# EAGLE schematic faout (EAGLE 7.1.0)
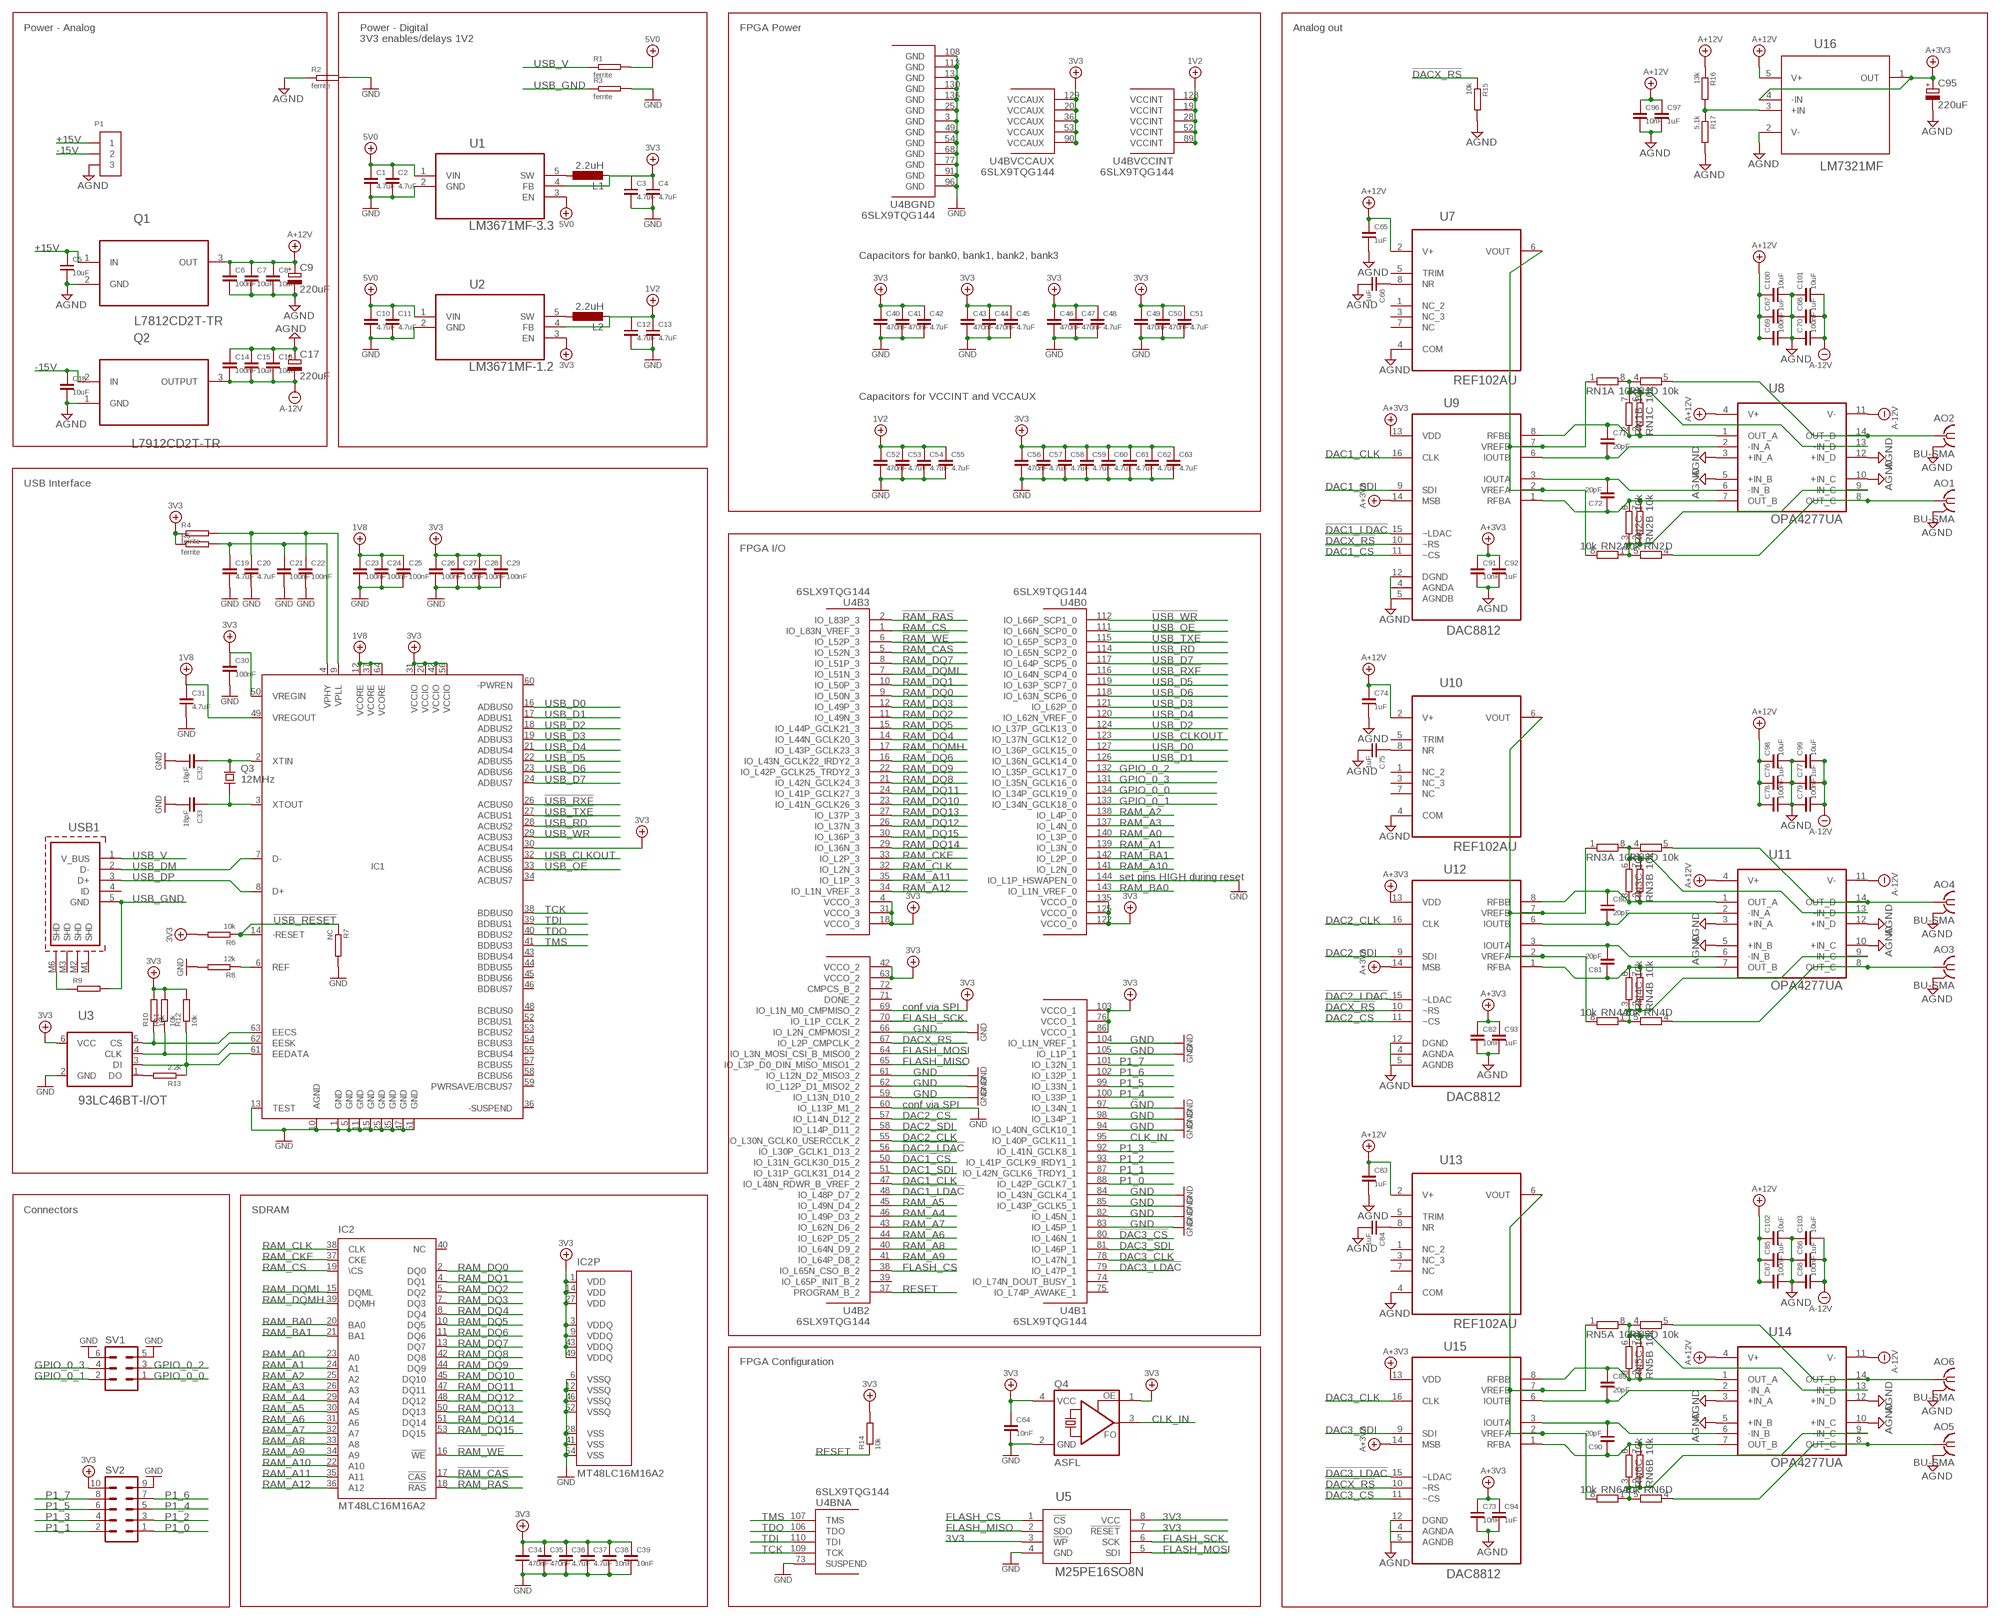
[diagram p0: schematic, sheet 1]

## Parts
AO1  BU-SMA  [BU-SMA-H]
AO2  BU-SMA  [BU-SMA-H]
AO3  BU-SMA  [BU-SMA-H]
AO4  BU-SMA  [BU-SMA-H]
AO5  BU-SMA  [BU-SMA-H]
AO6  BU-SMA  [BU-SMA-H]
C1  4.7uF  C_EU0603  [R0603]
C2  4.7uF  C_EU0603  [R0603]
C3  4.7uF  C_EU0603  [R0603]
C4  4.7uF  C_EU0603  [R0603]
C5  10uF  C_EU0805  [R0805]
C6  100nF  C_EU0603  [R0603]
C7  10uF  C_EU0805  [R0805]
C8  10uF  C_EU0805  [R0805]
C9  220uF  CPOL-EUE  [PANASONIC_E]
C10  4.7uF  C_EU0603  [R0603]
C11  4.7uF  C_EU0603  [R0603]
C12  4.7uF  C_EU0603  [R0603]
C13  4.7uF  C_EU0603  [R0603]
C14  100nF  C_EU0603  [R0603]
C15  10uF  C_EU0805  [R0805]
C16  10uF  C_EU0805  [R0805]
C17  220uF  CPOL-EUE  [PANASONIC_E]
C18  10uF  C_EU0805  [R0805]
C19  4.7uF  C_EU0603  [R0603]
C20  4.7uF  C_EU0603  [R0603]
C21  100nF  C_EU0603  [R0603]
C22  100nF  C_EU0603  [R0603]
C23  100nF  C_EU0603  [R0603]
C24  100nF  C_EU0603  [R0603]
C25  100nF  C_EU0603  [R0603]
C26  100nF  C_EU0603  [R0603]
C27  100nF  C_EU0603  [R0603]
C28  100nF  C_EU0603  [R0603]
C29  100nF  C_EU0603  [R0603]
C30  100nF  C_EU0603  [R0603]
C31  4.7uF  C_EU0603  [R0603]
C32  18pF  C_EU0603  [R0603]
C33  18pF  C_EU0603  [R0603]
C34  470nF  C_EU0603  [R0603]
C35  470nF  C_EU0603  [R0603]
C36  4.7uF  C_EU0603  [R0603]
C37  4.7uF  C_EU0603  [R0603]
C38  10nF  C_EU0603  [R0603]
C39  10nF  C_EU0603  [R0603]
C40  470nF  C_EU0603  [R0603]
C41  470nF  C_EU0603  [R0603]
C42  4.7uF  C_EU0603  [R0603]
C43  470nF  C_EU0603  [R0603]
C44  470nF  C_EU0603  [R0603]
C45  4.7uF  C_EU0603  [R0603]
C46  470nF  C_EU0603  [R0603]
C47  470nF  C_EU0603  [R0603]
C48  4.7uF  C_EU0603  [R0603]
C49  470nF  C_EU0603  [R0603]
C50  470nF  C_EU0603  [R0603]
C51  4.7uF  C_EU0603  [R0603]
C52  470nF  C_EU0603  [R0603]
C53  4.7uF  C_EU0603  [R0603]
C54  4.7uF  C_EU0603  [R0603]
C55  4.7uF  C_EU0603  [R0603]
C56  470nF  C_EU0603  [R0603]
C57  4.7uF  C_EU0603  [R0603]
C58  4.7uF  C_EU0603  [R0603]
C59  4.7uF  C_EU0603  [R0603]
C60  4.7uF  C_EU0603  [R0603]
C61  4.7uF  C_EU0603  [R0603]
C62  4.7uF  C_EU0603  [R0603]
C63  4.7uF  C_EU0603  [R0603]
C64  10nF  C_EU0603  [R0603]
C65  1uF  C_EU0603  [R0603]
C66  1uF  C_EU0603  [R0603]
C67  1uF  C_EU0603  [R0603]
C68  1uF  C_EU0603  [R0603]
C69  100nF  C_EU0603  [R0603]
C70  100nF  C_EU0603  [R0603]
C71  20pF  C_EU0603  [R0603]
C72  20pF  C_EU0603  [R0603]
C73  10nF  C_EU0603  [R0603]
C74  1uF  C_EU0603  [R0603]
C75  1uF  C_EU0603  [R0603]
C76  1uF  C_EU0603  [R0603]
C77  1uF  C_EU0603  [R0603]
C78  100nF  C_EU0603  [R0603]
C79  100nF  C_EU0603  [R0603]
C80  20pF  C_EU0603  [R0603]
C81  20pF  C_EU0603  [R0603]
C82  10nF  C_EU0603  [R0603]
C83  1uF  C_EU0603  [R0603]
C84  1uF  C_EU0603  [R0603]
C85  1uF  C_EU0603  [R0603]
C86  1uF  C_EU0603  [R0603]
C87  100nF  C_EU0603  [R0603]
C88  100nF  C_EU0603  [R0603]
C89  20pF  C_EU0603  [R0603]
C90  20pF  C_EU0603  [R0603]
C91  10nF  C_EU0603  [R0603]
C92  1uF  C_EU0603  [R0603]
C93  1uF  C_EU0603  [R0603]
C94  1uF  C_EU0603  [R0603]
C95  220uF  CPOL-EUE  [PANASONIC_E]
C96  10nF  C_EU0603  [R0603]
C97  1uF  C_EU0603  [R0603]
C98  10uF  C_EU0805  [R0805]
C99  10uF  C_EU0805  [R0805]
C100  10uF  C_EU0805  [R0805]
C101  10uF  C_EU0805  [R0805]
C102  10uF  C_EU0805  [R0805]
C103  10uF  C_EU0805  [R0805]
IC1  FT2232HL  [TQFP64-12X12]
IC2  MT48LC16M16A2  [TSOP54-400]
L1  2.2uH  L-EUL5038P  [L5038P]
L2  2.2uH  L-EUL5038P  [L5038P]
P1  TE_CONN_MTE_HEADER3R  [TE_CONN_MTE_HEADER3_R]
Q1  L7812CD2T-TR  [TO254P1524X460-3N]
Q2  L7912CD2T-TR  [TO254P1524X460-3N]
Q3  12MHz  TXC_QUARTZ_7A  [TXC_QUARTZ_7A]
Q4  ASFL  [ASF]
R1  ferrite  R_EU1206  [R1206]
R2  ferrite  R_EU1206  [R1206]
R3  ferrite  R_EU1206  [R1206]
R4  ferrite  R_EU0603  [R0603]
R5  ferrite  R_EU0603  [R0603]
R6  10k  R_EU0603  [R0603]
R7  NC  R_EU0603  [R0603]
R8  12k  R_EU0603  [R0603]
R9  R_EU0603  [R0603]
R10  10k  R_EU0603  [R0603]
R11  10k  R_EU0603  [R0603]
R12  10k  R_EU0603  [R0603]
R13  2.2k  R_EU0603  [R0603]
R14  10k  R_EU0603  [R0603]
R15  10k  R_EU0603  [R0603]
R16  13k  R_EU0603  [R0603]
R17  5.1k  R_EU0603  [R0603]
RN1  10k  4R-NEXBV8V  [EXBV8V]
RN2  10k  4R-NEXBV8V  [EXBV8V]
RN3  10k  4R-NEXBV8V  [EXBV8V]
RN4  10k  4R-NEXBV8V  [EXBV8V]
RN5  10k  4R-NEXBV8V  [EXBV8V]
RN6  10k  4R-NEXBV8V  [EXBV8V]
SV1  ML6L  [ML6L]
SV2  ML10  [ML10]
U1  LM3671MF-3.3  [SOT95P284X122-5N]
U2  LM3671MF-1.2  [SOT95P284X122-5N]
U3  93LC46BT-I/OT  [SOT95P280X145-6N]
U4  6SLX9TQG144  [TQ144]
U5  M25PE16SO8N  [SOIC127P600X175-8N]
U7  REF102AU  [SOIC127P600X175-8N]
U8  OPA4277UA  [SOIC127P600X175-14N]
U9  DAC8812  [SOP65P640X120-16N]
U10  REF102AU  [SOIC127P600X175-8N]
U11  OPA4277UA  [SOIC127P600X175-14N]
U12  DAC8812  [SOP65P640X120-16N]
U13  REF102AU  [SOIC127P600X175-8N]
U14  OPA4277UA  [SOIC127P600X175-14N]
U15  DAC8812  [SOP65P640X120-16N]
U16  LM7321MF  [SOT95P300X120-5N]
USB1  MOLEX_USB_105017-0001  [MOLEX_105017-0001]

## Nets
1V2: C12.1 C13.1 C52.1 C53.1 C54.1 C55.1 L2.2 U2.4(FB) U4.19(BVCCINT:VCCINT) U4.28(BVCCINT:VCCINT) U4.52(BVCCINT:VCCINT) U4.89(BVCCINT:VCCINT) U4.128(BVCCINT:VCCINT)
1V8: C23.1 C24.1 C25.1 C31.1 IC1.12(VCORE) IC1.37(VCORE) IC1.49(VREGOUT) IC1.64(VCORE)
3V3: C3.1 C4.1 C26.1 C27.1 C28.1 C29.1 C30.1 C34.1 C35.1 C36.1 C37.1 C38.1 C39.1 C40.1 C41.1 C42.1 C43.1 C44.1 C45.1 C46.1 C47.1 C48.1 C49.1 C50.1 C51.1 C56.1 C57.1 C58.1 C59.1 C60.1 C61.1 C62.1 C63.1 C64.1 IC1.20(VCCIO) IC1.30(ACBUS4) IC1.31(VCCIO) IC1.42(VCCIO) IC1.50(VREGIN) IC1.56(VCCIO) IC2.1(VDD) IC2.3(VDDQ) IC2.9(VDDQ) IC2.14(VDD) IC2.27(VDD) IC2.43(VDDQ) IC2.49(VDDQ) L1.2 Q4.1(OE) Q4.4(VCC) R4.1 R5.1 R6.2 R10.2 R11.2 R12.2 R14.2 SV2.10 U1.4(FB) U2.3(EN) U3.6(VCC) U4.4(B3:VCCO_3) U4.18(B3:VCCO_3) U4.20(BVCCAUX:VCCAUX) U4.31(B3:VCCO_3) U4.36(BVCCAUX:VCCAUX) U4.42(B2:VCCO_2) U4.53(BVCCAUX:VCCAUX) U4.63(B2:VCCO_2) U4.69(B2:IO_L1N_M0_CMPMISO_2) U4.76(B1:VCCO_1) U4.86(B1:VCCO_1) U4.90(BVCCAUX:VCCAUX) U4.103(B1:VCCO_1) U4.122(B0:VCCO_0) U4.125(B0:VCCO_0) U4.129(BVCCAUX:VCCAUX) U4.135(B0:VCCO_0) U5.3(!WP) U5.7(!RESET) U5.8(VCC)
5V0: C1.1 C2.1 C10.1 C11.1 R1.2 U1.1(VIN) U1.3(EN) U2.1(VIN)
!DAC1_CS: U4.50(B2:IO_L31N_GCLK30_D15_2) U9.11(~CS)
!DAC1_LDAC: U4.48(B2:IO_L48P_D7_2) U9.15(~LDAC)
!DAC2_CS: U4.57(B2:IO_L14N_D12_2) U12.11(~CS)
!DAC2_LDAC: U4.56(B2:IO_L30P_GCLK1_D13_2) U12.15(~LDAC)
!DAC3_CS: U4.80(B1:IO_L46N_1) U15.11(~CS)
!DAC3_LDAC: U4.79(B1:IO_L47P_1) U15.15(~LDAC)
!DACX_RS: R15.1 U4.67(B2:IO_L2P_CMPCLK_2) U9.10(~RS) U12.10(~RS) U15.10(~RS)
!RAM_CAS: IC2.17(!CAS) U4.5(B3:IO_L52N_3)
!RAM_RAS: IC2.18(!RAS) U4.2(B3:IO_L83P_3)
!RAM_WE: IC2.16(!WE) U4.6(B3:IO_L52P_3)
!USB_OE: IC1.33(ACBUS6) U4.111(B0:IO_L66N_SCP0_0)
!USB_RD: IC1.28(ACBUS2) U4.114(B0:IO_L65N_SCP2_0)
!USB_RESET: IC1.14(-RESET) R6.1 R7.1
!USB_RXF: IC1.26(ACBUS0) U4.116(B0:IO_L64N_SCP4_0)
!USB_TXE: IC1.27(ACBUS1) U4.115(B0:IO_L65P_SCP3_0)
!USB_WR: IC1.29(ACBUS3) U4.112(B0:IO_L66P_SCP1_0)
+15V: C5.1 P1.P$1 Q1.1(IN)
-15V: C18.1 P1.P$2 Q2.2(IN)
A+3V3: C73.1 C82.1 C91.1 C92.1 C93.1 C94.1 C95.+ U9.13(VDD) U9.14(MSB) U12.13(VDD) U12.14(MSB) U15.13(VDD) U15.14(MSB) U16.1(OUT) U16.4(-IN)
A+12V: C6.1 C7.1 C8.1 C9.+ C65.1 C67.1 C69.1 C74.1 C76.1 C78.1 C83.1 C85.1 C87.1 C96.1 C97.1 C98.1 C100.1 C102.1 Q1.3(OUT) R16.1 U7.2(V+) U8.4(V+) U10.2(V+) U11.4(V+) U13.2(V+) U14.4(V+) U16.5(V+)
A-12V: C14.2 C15.2 C16.2 C17.- C68.2 C70.2 C77.2 C79.2 C86.2 C88.2 C99.2 C101.2 C103.2 Q2.3(OUTPUT) U8.11(V-) U11.11(V-) U14.11(V-)
AGND: AO1.2 AO1.3 AO1.4 AO1.5 AO2.2 AO2.3 AO2.4 AO2.5 AO3.2 AO3.3 AO3.4 AO3.5 AO4.2 AO4.3 AO4.4 AO4.5 AO5.2 AO5.3 AO5.4 AO5.5 AO6.2 AO6.3 AO6.4 AO6.5 C5.2 C6.2 C7.2 C8.2 C9.- C14.1 C15.1 C16.1 C17.+ C18.2 C65.2 C66.2 C67.2 C68.1 C69.2 C70.1 C73.2 C74.2 C75.2 C76.2 C77.1 C78.2 C79.1 C82.2 C83.2 C84.2 C85.2 C86.1 C87.2 C88.1 C91.2 C92.2 C93.2 C94.2 C95.- C96.2 C97.2 C98.2 C99.1 C100.2 C101.1 C102.2 C103.1 P1.P$3 Q1.2(GND) Q2.1(GND) R2.1 R15.2 R17.2 U7.4(COM) U8.3(+IN_A) U8.5(+IN_B) U8.10(+IN_C) U8.12(+IN_D) U9.4(AGNDA) U9.5(AGNDB) U9.12(DGND) U10.4(COM) U11.3(+IN_A) U11.5(+IN_B) U11.10(+IN_C) U11.12(+IN_D) U12.4(AGNDA) U12.5(AGNDB) U12.12(DGND) U13.4(COM) U14.3(+IN_A) U14.5(+IN_B) U14.10(+IN_C) U14.12(+IN_D) U15.4(AGNDA) U15.5(AGNDB) U15.12(DGND) U16.2(V-)
CLK_IN: Q4.3(FO) U4.95(B1:IO_L40P_GCLK11_1)
DAC1_CLK: U4.47(B2:IO_L48N_RDWR_B_VREF_2) U9.16(CLK)
DAC1_IOUTA: C72.2 U8.6(-IN_B) U9.3(IOUTA)
DAC1_IOUTB: C71.2 U8.2(-IN_A) U9.6(IOUTB)
DAC1_RFBA: C72.1 RN2.6 RN2.7 U8.7(OUT_B) U9.1(RFBA)
DAC1_RFBB: C71.1 RN1.2 RN1.3 U8.1(OUT_A) U9.8(RFBB)
DAC1_SDI: U4.51(B2:IO_L31P_GCLK31_D14_2) U9.9(SDI)
DAC1_VOUTA: AO1.1 RN2.4 U8.8(OUT_C)
DAC1_VOUTB: AO2.1 RN1.5 U8.14(OUT_D)
DAC1_VREF: RN1.1 RN2.8 U7.6(VOUT) U9.2(VREFA) U9.7(VREFB)
DAC2_CLK: U4.55(B2:IO_L30N_GCLK0_USERCCLK_2) U12.16(CLK)
DAC2_IOUTA: C81.2 U11.6(-IN_B) U12.3(IOUTA)
DAC2_IOUTB: C80.2 U11.2(-IN_A) U12.6(IOUTB)
DAC2_RFBA: C81.1 RN4.6 RN4.7 U11.7(OUT_B) U12.1(RFBA)
DAC2_RFBB: C80.1 RN3.2 RN3.3 U11.1(OUT_A) U12.8(RFBB)
DAC2_SDI: U4.58(B2:IO_L14P_D11_2) U12.9(SDI)
DAC2_VOUTA: AO3.1 RN4.4 U11.8(OUT_C)
DAC2_VOUTB: AO4.1 RN3.5 U11.14(OUT_D)
DAC2_VREF: RN3.1 RN4.8 U10.6(VOUT) U12.2(VREFA) U12.7(VREFB)
DAC3_CLK: U4.78(B1:IO_L47N_1) U15.16(CLK)
DAC3_IOUTA: C90.2 U14.6(-IN_B) U15.3(IOUTA)
DAC3_IOUTB: C89.2 U14.2(-IN_A) U15.6(IOUTB)
DAC3_RFBA: C90.1 RN6.6 RN6.7 U14.7(OUT_B) U15.1(RFBA)
DAC3_RFBB: C89.1 RN5.2 RN5.3 U14.1(OUT_A) U15.8(RFBB)
DAC3_SDI: U4.81(B1:IO_L46P_1) U15.9(SDI)
DAC3_VOUTA: AO5.1 RN6.4 U14.8(OUT_C)
DAC3_VOUTB: AO6.1 RN5.5 U14.14(OUT_D)
DAC3_VREF: RN5.1 RN6.8 U13.6(VOUT) U15.2(VREFA) U15.7(VREFB)
EECS: IC1.63(EECS) R10.1 U3.5(CS)
EEDATA: IC1.61(EEDATA) R12.1 R13.1 U3.3(DI)
EESK: IC1.62(EESK) R11.1 U3.4(CLK)
FLASH_CS: U4.38(B2:IO_L65N_CSO_B_2) U5.1(!CS)
FLASH_MISO: U4.65(B2:IO_L3P_D0_DIN_MISO_MISO1_2) U5.2(SDO)
FLASH_MOSI: U4.64(B2:IO_L3N_MOSI_CSI_B_MISO0_2) U5.5(SDI)
FLASH_SCK: U4.70(B2:IO_L1P_CCLK_2) U5.6(SCK)
GND: C1.2 C2.2 C3.2 C4.2 C10.2 C11.2 C12.2 C13.2 C19.2 C20.2 C21.2 C22.2 C23.2 C24.2 C25.2 C26.2 C27.2 C28.2 C29.2 C30.2 C31.2 C32.2 C33.2 C34.2 C35.2 C36.2 C37.2 C38.2 C39.2 C40.2 C41.2 C42.2 C43.2 C44.2 C45.2 C46.2 C47.2 C48.2 C49.2 C50.2 C51.2 C52.2 C53.2 C54.2 C55.2 C56.2 C57.2 C58.2 C59.2 C60.2 C61.2 C62.2 C63.2 C64.2 IC1.1(GND) IC1.5(GND) IC1.10(AGND) IC1.11(GND) IC1.13(TEST) IC1.15(GND) IC1.25(GND) IC1.35(GND) IC1.47(GND) IC1.51(GND) IC2.6(VSSQ) IC2.12(VSSQ) IC2.28(VSS) IC2.41(VSS) IC2.46(VSSQ) IC2.52(VSSQ) IC2.54(VSS) Q4.2(GND) R2.2 R3.2 R7.2 R8.2 SV1.5 SV1.6 SV2.9 U1.2(GND) U2.2(GND) U3.2(GND) U4.3(BGND:GND) U4.13(BGND:GND) U4.25(BGND:GND) U4.49(BGND:GND) U4.54(BGND:GND) U4.59(B2:IO_L13N_D10_2) U4.60(B2:IO_L13P_M1_2) U4.61(B2:IO_L12N_D2_MISO3_2) U4.62(B2:IO_L12P_D1_MISO2_2) U4.66(B2:IO_L2N_CMPMOSI_2) U4.68(BGND:GND) U4.73(BNA:SUSPEND) U4.77(BGND:GND) U4.82(B1:IO_L45N_1) U4.83(B1:IO_L45P_1) U4.84(B1:IO_L43N_GCLK4_1) U4.85(B1:IO_L43P_GCLK5_1) U4.91(BGND:GND) U4.94(B1:IO_L40N_GCLK10_1) U4.96(BGND:GND) U4.97(B1:IO_L34N_1) U4.98(B1:IO_L34P_1) U4.104(B1:IO_L1N_VREF_1) U4.105(B1:IO_L1P_1) U4.108(BGND:GND) U4.113(BGND:GND) U4.130(BGND:GND) U4.136(BGND:GND) U4.144(B0:IO_L1P_HSWAPEN_0) U5.4(GND)
GPIO_0_0: SV1.1 U4.134(B0:IO_L34P_GCLK19_0)
GPIO_0_1: SV1.2 U4.133(B0:IO_L34N_GCLK18_0)
GPIO_0_2: SV1.3 U4.132(B0:IO_L35P_GCLK17_0)
GPIO_0_3: SV1.4 U4.131(B0:IO_L35N_GCLK16_0)
N$1: C32.1 IC1.2(XTIN) Q3.1
N$2: C33.1 IC1.3(XTOUT) Q3.2
N$4: C66.1 U7.8(NR)
N$5: C19.1 C21.1 IC1.4(VPHY) R5.2
N$6: R13.2 U3.1(DO)
N$7: C20.1 C22.1 IC1.9(VPLL) R4.2
N$8: RN2.1 RN2.2 RN2.3 RN2.5 U8.9(-IN_C)
N$9: RN4.1 RN4.2 RN4.3 RN4.5 U11.9(-IN_C)
N$10: RN5.4 RN5.6 RN5.7 RN5.8 U14.13(-IN_D)
N$11: C75.1 U10.8(NR)
N$12: C84.1 U13.8(NR)
N$13: R16.2 R17.1 U16.3(+IN)
N$14: RN6.1 RN6.2 RN6.3 RN6.5 U14.9(-IN_C)
N$15: R9.1 USB1.M6(SHD)
N$16: RN1.4 RN1.6 RN1.7 RN1.8 U8.13(-IN_D)
N$17: RN3.4 RN3.6 RN3.7 RN3.8 U11.13(-IN_D)
N$24: L1.1 U1.5(SW)
N$25: L2.1 U2.5(SW)
P1_0: SV2.1 U4.88(B1:IO_L42P_GCLK7_1)
P1_1: SV2.2 U4.87(B1:IO_L42N_GCLK6_TRDY1_1)
P1_2: SV2.3 U4.93(B1:IO_L41P_GCLK9_IRDY1_1)
P1_3: SV2.4 U4.92(B1:IO_L41N_GCLK8_1)
P1_4: SV2.5 U4.100(B1:IO_L33P_1)
P1_5: SV2.6 U4.99(B1:IO_L33N_1)
P1_6: SV2.7 U4.102(B1:IO_L32P_1)
P1_7: SV2.8 U4.101(B1:IO_L32N_1)
RAM_A0: IC2.23(A0) U4.140(B0:IO_L3P_0)
RAM_A1: IC2.24(A1) U4.139(B0:IO_L3N_0)
RAM_A2: IC2.25(A2) U4.138(B0:IO_L4P_0)
RAM_A3: IC2.26(A3) U4.137(B0:IO_L4N_0)
RAM_A4: IC2.29(A4) U4.46(B2:IO_L49P_D3_2)
RAM_A5: IC2.30(A5) U4.45(B2:IO_L49N_D4_2)
RAM_A6: IC2.31(A6) U4.44(B2:IO_L62P_D5_2)
RAM_A7: IC2.32(A7) U4.43(B2:IO_L62N_D6_2)
RAM_A8: IC2.33(A8) U4.40(B2:IO_L64N_D9_2)
RAM_A9: IC2.34(A9) U4.41(B2:IO_L64P_D8_2)
RAM_A10: IC2.22(A10) U4.141(B0:IO_L2N_0)
RAM_A11: IC2.35(A11) U4.35(B3:IO_L1P_3)
RAM_A12: IC2.36(A12) U4.34(B3:IO_L1N_VREF_3)
RAM_BA0: IC2.20(BA0) U4.143(B0:IO_L1N_VREF_0)
RAM_BA1: IC2.21(BA1) U4.142(B0:IO_L2P_0)
RAM_CKE: IC2.37(CKE) U4.33(B3:IO_L2P_3)
RAM_CLK: IC2.38(CLK) U4.32(B3:IO_L2N_3)
RAM_CS: IC2.19(\CS) U4.1(B3:IO_L83N_VREF_3)
RAM_DQ0: IC2.2(DQ0) U4.9(B3:IO_L50N_3)
RAM_DQ1: IC2.4(DQ1) U4.10(B3:IO_L50P_3)
RAM_DQ2: IC2.5(DQ2) U4.11(B3:IO_L49N_3)
RAM_DQ3: IC2.7(DQ3) U4.12(B3:IO_L49P_3)
RAM_DQ4: IC2.8(DQ4) U4.14(B3:IO_L44N_GCLK20_3)
RAM_DQ5: IC2.10(DQ5) U4.15(B3:IO_L44P_GCLK21_3)
RAM_DQ6: IC2.11(DQ6) U4.16(B3:IO_L43N_GCLK22_IRDY2_3)
RAM_DQ7: IC2.13(DQ7) U4.8(B3:IO_L51P_3)
RAM_DQ8: IC2.42(DQ8) U4.21(B3:IO_L42N_GCLK24_3)
RAM_DQ9: IC2.44(DQ9) U4.22(B3:IO_L42P_GCLK25_TRDY2_3)
RAM_DQ10: IC2.45(DQ10) U4.23(B3:IO_L41N_GCLK26_3)
RAM_DQ11: IC2.47(DQ11) U4.24(B3:IO_L41P_GCLK27_3)
RAM_DQ12: IC2.48(DQ12) U4.26(B3:IO_L37N_3)
RAM_DQ13: IC2.50(DQ13) U4.27(B3:IO_L37P_3)
RAM_DQ14: IC2.51(DQ14) U4.29(B3:IO_L36N_3)
RAM_DQ15: IC2.53(DQ15) U4.30(B3:IO_L36P_3)
RAM_DQMH: IC2.39(DQMH) U4.17(B3:IO_L43P_GCLK23_3)
RAM_DQML: IC2.15(DQML) U4.7(B3:IO_L51N_3)
RESET: R14.1 U4.37(B2:PROGRAM_B_2)
TCK: IC1.38(BDBUS0) U4.109(BNA:TCK)
TDI: IC1.39(BDBUS1) U4.110(BNA:TDI)
TDO: IC1.40(BDBUS2) U4.106(BNA:TDO)
TMS: IC1.41(BDBUS3) U4.107(BNA:TMS)
USB_CLKOUT: IC1.32(ACBUS5) U4.123(B0:IO_L37N_GCLK12_0)
USB_D0: IC1.16(ADBUS0) U4.127(B0:IO_L36P_GCLK15_0)
USB_D1: IC1.17(ADBUS1) U4.126(B0:IO_L36N_GCLK14_0)
USB_D2: IC1.18(ADBUS2) U4.124(B0:IO_L37P_GCLK13_0)
USB_D3: IC1.19(ADBUS3) U4.121(B0:IO_L62P_0)
USB_D4: IC1.21(ADBUS4) U4.120(B0:IO_L62N_VREF_0)
USB_D5: IC1.22(ADBUS5) U4.119(B0:IO_L63P_SCP7_0)
USB_D6: IC1.23(ADBUS6) U4.118(B0:IO_L63N_SCP6_0)
USB_D7: IC1.24(ADBUS7) U4.117(B0:IO_L64P_SCP5_0)
USB_DM: IC1.7(D-) USB1.2(D-)
USB_DP: IC1.8(D+) USB1.3(D+)
USB_GND: R3.1 R9.2 USB1.5(GND)
USB_REF: IC1.6(REF) R8.1
USB_V: R1.1 USB1.1(V_BUS)
Unconnected: IC1.34(ACBUS7) IC1.36(-SUSPEND) IC1.43(BDBUS4) IC1.44(BDBUS5) IC1.45(BDBUS6) IC1.46(BDBUS7) IC1.48(BCBUS0) IC1.52(BCBUS1) IC1.53(BCBUS2) IC1.54(BCBUS3) IC1.55(BCBUS4) IC1.57(BCBUS5) IC1.58(BCBUS6) IC1.59(PWRSAVE/BCBUS7) IC1.60(-PWREN) IC2.40(NC) U4.39(B2:IO_L65P_INIT_B_2) U4.71(B2:DONE_2) U4.72(B2:CMPCS_B_2) U4.74(B1:IO_L74N_DOUT_BUSY_1) U4.75(B1:IO_L74P_AWAKE_1) U7.1(NC_2) U7.3(NC_3) U7.5(TRIM) U7.7(NC) U10.1(NC_2) U10.3(NC_3) U10.5(TRIM) U10.7(NC) U13.1(NC_2) U13.3(NC_3) U13.5(TRIM) U13.7(NC) USB1.4(ID) USB1.M1(SHD) USB1.M2(SHD) USB1.M3(SHD)

## Notes on the sheet
- Power - Analog | Power - Digital | FPGA Power | Analog out
- 3V3 enables/delays 1V2
- Capacitors for bank0, bank1, bank2, bank3
- Capacitors for VCCINT and VCCAUX
- USB Interface
- FPGA I/O
- set pins HIGH during reset
- conf via SPI
- conf via SPI
- Connectors | SDRAM
- FPGA Configuration

## Library data of the parts
AO1-AO6 = analog_out_lib:BU-SMA: FEMALE SMA CONNECTOR Radiall; OC_FARNELL: 1248989
C1-C4 C10-C13 C19 C20 C31 C36 C37 C42 C45 C48 C51 C53-C55 C57-C63 = faout:C_EU: Capacitor, EU Symbol; OC_FARNELL: 1833803
C5 C7 C8 C15 C16 C18 = faout:C_EU: Capacitor, EU Symbol; OC_FARNELL: 1867958
C6 C14 C21-C30 C69 C70 C78 C79 C87 C88 = faout:C_EU: Capacitor, EU Symbol; OC_FARNELL: 1740621
C9 C17 C95 = rcl:CPOL-EU: POLARIZED CAPACITOR, European symbol; OC_FARNELL: 9695680
C32 C33 C71 C72 C80 C81 C89 C90 = faout:C_EU: Capacitor, EU Symbol
C34 C35 C40 C41 C43 C44 C46 C47 C49 C50 C52 C56 = faout:C_EU: Capacitor, EU Symbol; OC_FARNELL: 1867949
C38 C39 C64 C73 C82 C91 C96 = faout:C_EU: Capacitor, EU Symbol; OC_FARNELL: 1759102
C65-C68 C74-C77 C83-C86 C92-C94 C97 = faout:C_EU: Capacitor, EU Symbol; OC_FARNELL: 1759409
C98-C103 = faout:C_EU: Capacitor, EU Symbol; OC_FARNELL: 1735530
IC1 = ftdichip-3:FT2232H: FT2232H USB2.0 High speed dual Serial/FIFO controller 64 pin device; OC_FARNELL: 1697461
IC2 = faout:MT48LC: Micron SDR SDRAM; OC_FARNELL: 2253738
L1 L2 = rcl:L-EU: INDUCTOR, European symbol; OC_FARNELL: 2145272
P1 = faout:TE_CONN_MTE_HEADER3; OC_FARNELL: 2429542
Q1 = faout:L7812CD2T-TR: V REG, 2VDO, 1.5A, 12V, 5%, 3D2PAK; MPN: L7812CD2T-TR; OC_FARNELL: 2296017; OC_NEWARK: 89K1392; PACKAGE: D2PAK; SUPPLIER: STMicroelectronics
Q2 = faout:L7912CD2T-TR; OC_FARNELL: 1564324
Q3 = faout:TXC_QUARTZ_7A; OC_FARNELL: 1841940
Q4 = crystal:ASF*: CRYSTAL CLOCK OSCILLATORS 5.0 Vdc or 3.3 Vdc - LOW PROFILE ULTRA MINIATURE CERAMIC SURFACE MOUNT Source: http://www.abracon.com/Oscillators/asf1-L-L1.pdf; MPN: ASFLM1-50.000MHZ-C-T; OC_FARNELL: 1838931; OC_NEWARK: 99M0411
R1-R3 = faout:R_EU: Resistor, EU Symbol; OC_FARNELL: 1612060
R4 R5 = faout:R_EU: Resistor, EU Symbol; OC_FARNELL: 1463451
R6-R17 = faout:R_EU: Resistor, EU Symbol
RN1-RN6 = resistor-dil:4R-N: Array Chip Resistor Source: RS Component / Phycomp; OC_FARNELL: 1560925; OC_NEWARK: unknown
SV1 = con-ml:ML6L: HARTING; OC_FARNELL: 2356262; OC_NEWARK: unknown
SV2 = con-ml:ML10: HARTING; OC_FARNELL: unknown; OC_NEWARK: unknown
U1 = faout:LM3671MF-3.3: IC BUCK SYNC 3.3V 0.6A; MPN: LM3671MF-3.3; OC_FARNELL: 1685767; OC_NEWARK: 79K7838; PACKAGE: 5-SOT-23; SUPPLIER: NationalSemiconductor
U2 = faout:LM3671MF-1.2: IC BUCK SYNC 1.2V 0.6A; MPN: LM3671MF-1.2; OC_FARNELL: 1685653; OC_NEWARK: 41K4937; PACKAGE: 5-SOT-23; SUPPLIER: NationalSemiconductor
U3 = faout:93LC46BT-I/OT: 1K Microwire Compatible Serial EEPROM; MPN: 93LC46BT-I/OT; OC_FARNELL: 1556164; OC_NEWARK: 75M3689; PACKAGE: SOT-6; SUPPLIER: Microchip
U4 = faout:6SLX9TQG144: Xilinx FPGA: 6SLX9TQG144; OC_FARNELL: 1876228
U5 = faout:M25PE16; OC_FARNELL: 1734973
U7 U10 U13 = faout:REF102AU: 10V Precision Voltage Reference; MPN: REF102AU; OC_FARNELL: 1212344; OC_NEWARK: 04M4600; PACKAGE: SOIC-8; SUPPLIER: Texas Instruments
U8 U11 U14 = faout:OPA4277UA: High Precision OPERATIONAL AMPLIFIERS; MPN: OPA4277UA; OC_FARNELL: 1097479; OC_NEWARK: 24C8771; PACKAGE: SOIC-14; SUPPLIER: Texas Instruments
U9 U12 U15 = faout:DAC8812: DAC; MPN: DAC8812; OC_FARNELL: 1390687; PACKAGE: TSSOP-16; SUPPLIER: Texas Instruments
U16 = faout:LM7321MF: Operational Amplifier; MPN: LM7321MF; OC_FARNELL: 1663013; OC_NEWARK: 11N9285; PACKAGE: SOT-23-5; SUPPLIER: National Semiconductors
USB1 = faout:MOLEX_USB_: Micro USB Connector; OC_FARNELL: 2293836

## Net classes
1 spaceing: clearance 0.5 mm